# Altium project Capstone_Altium_Guide.PrjPcb
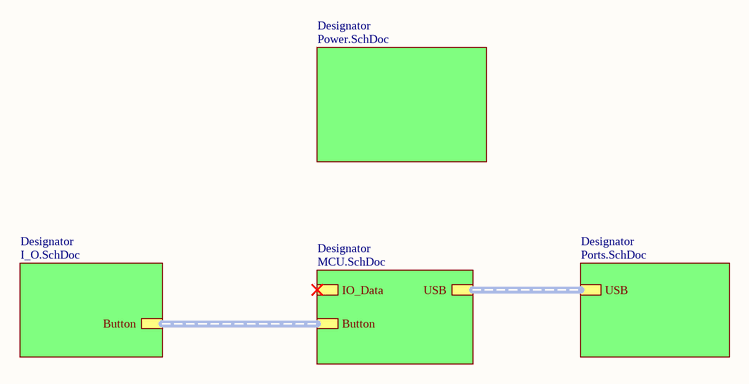
[diagram p0: Top_Level.SchDoc]
5 sheets, 56 parts. Net scope: hierarchical (ports join the sheet entries above them; power ports are global).
Board file: AltiumHandbook.PcbDoc
Sheets:
  Top_Level.SchDoc
    Designator = I_O.SchDoc
    Designator = MCU.SchDoc
    Designator = Ports.SchDoc
    Designator = Power.SchDoc

## Sheet Top_Level.SchDoc: ESP32 ESP Home Template
size A4; DrawnBy: Tim Baker; Revision: 1; SheetNumber: 1; SheetTotal: 5

### Sub-sheets
Designator = I_O.SchDoc: Button (harness Button)
Designator = MCU.SchDoc: IO_Data (harness IO), USB (harness USB), Button (harness Button)
Designator = Ports.SchDoc: USB (harness USB)
Designator = Power.SchDoc: no entries

## Sheet I_O.SchDoc
size A4; SheetNumber: 4; SheetTotal: 5
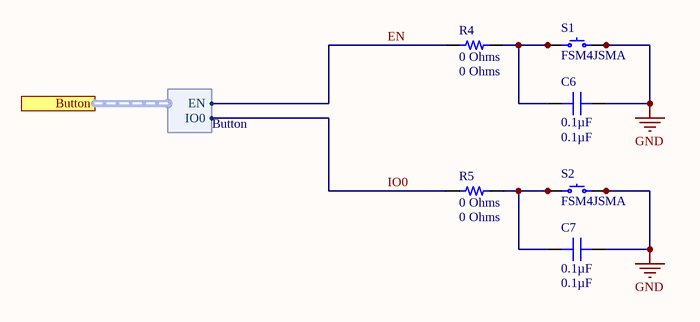
[diagram p1: I_O.SchDoc]

### Parts
C6  0.1µF  [CAP 0805_2012]
C7  0.1µF  [CAP 0805_2012]
R4  0 Ohms  [RES 0805_2012]
R5  0 Ohms  [RES 0805_2012]
S1  FSM4JSMA  [TE FSM4JSMA]
S2  FSM4JSMA  [TE FSM4JSMA]

### Ports
Button (harness Button)

### Harnesses
Button: EN, IO0

### Nets
GND: C6.1 C7.1 S1.3 S1.4 S2.3 S2.4
EN: R4.1 ; port Button.EN
IO0: R5.1 ; port Button.IO0
NetC6_2: C6.2 R4.2 S1.1 S1.2
NetC7_2: C7.2 R5.2 S2.1 S2.2

### Library data of the parts
C6 C7 = 0805ZD104KAT2A: CAP CER 0.1UF 10V X5R 0805; Part Number: 0805ZD104KAT2A; Value: 0.1µF
R4 R5 = CRCW08050000Z0EBC: RES 0 OHM JUMPER 1/8W 0805; Part Number: CRCW08050000Z0EBC; Value: 0 Ohms
S1 S2 = FSM4JSMA: SWITCH TACTILE SPST-NO 0.05A 24V; Manufacturer: TE Connectivity ALCOSWITCH Switches; Actuator Height off PCB, Vertical: 5.00mm; Actuator Orientation: Top Actuated; Actuator Type: Standard; Contact Rating @ Voltage: 0.05A @ 24VDC; Illumination: Non-Illuminated; Operating Force: 160gf; Outline: 6.00mm x 6.00mm; Switch Function: Off-Mom; Part Number: FSM4JSMA; Circuit: SPST-NO; ComponentLink1Description: Datasheet; ComponentLink1URL: https://www.te.com/commerce/DocumentDelivery/DDEController?Action=srchrtrv&DocNm=1308111-1_SWITCHES_CORE_PROGRAM_CATALOG&DocType=CS&DocLang=English; ComponentLink2Description: DigiKey Link; ComponentLink2URL: https://www.digikey.com/en/products/detail/te-connectivity-alcoswitch-switches/FSM4JSMA/525821; LastUpdated: 19/09/2022 2:02:57 PM; Lifecycle Status: Active; Minimum Order: 1; Mounting Type: Surface Mount; Operating Temperature: -35°C ~ 85°C; Packaging: Bulk; Part Status: Active; Price: 0.14; Series: FSMJSMA; Supplier 1: DigiKey; Supplier Part Number 1: 450-1129-ND; Termination Style: Gull Wing

## Sheet MCU.SchDoc
size A4; SheetNumber: 2; SheetTotal: 5
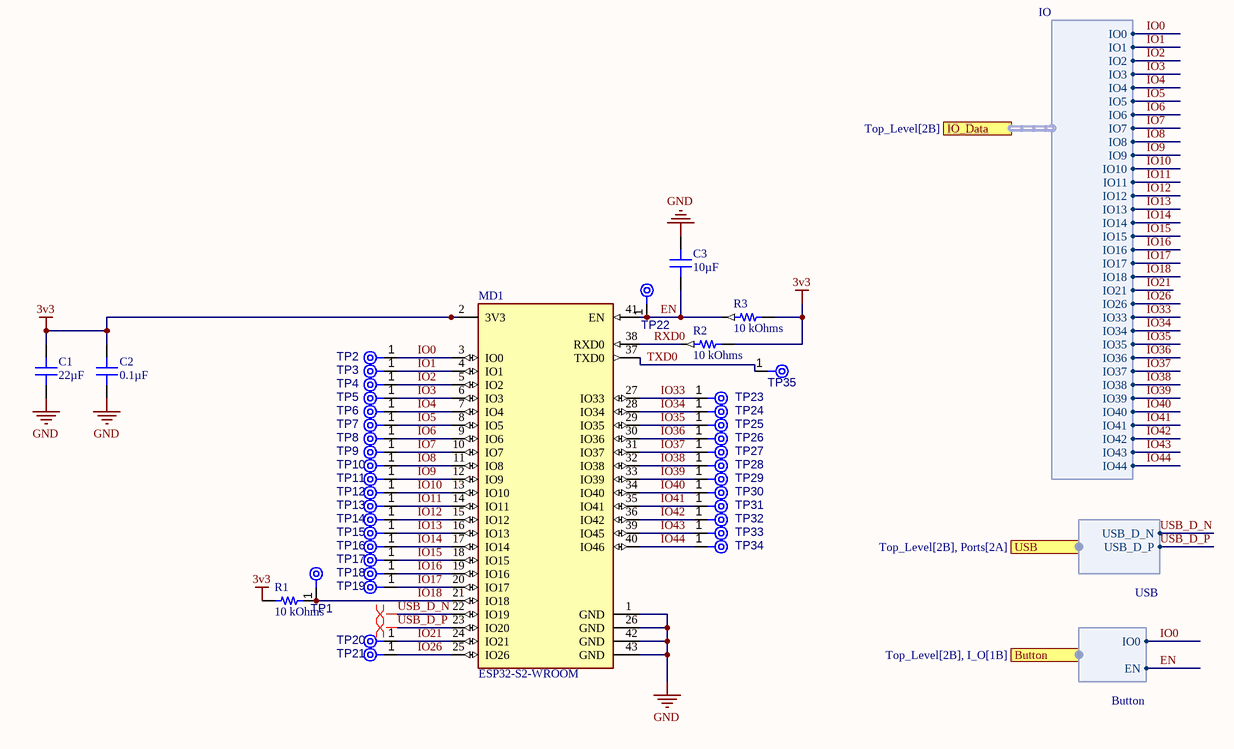
[diagram p2: MCU.SchDoc]

### Parts
C1  22µF  [CAP 0805_2012]
C2  0.1µF  [CAP 0805_2012]
C3  10µF  [CAP 0805_2012]
MD1  ESP32-S2-WROOM  [FP-ESP32-S2-WROOM-MFG]
R1  10 kOhms  [RES 0805_2012]
R2  10 kOhms  [RES 0805_2012]
R3  10 kOhms  [RES 0805_2012]
TP1  TPAD1.0R  [TP06R]  (value not drawn)  (no BOM)
TP2  TPAD1.0R  [TP06R]  (value not drawn)  (no BOM)
TP3  TPAD1.0R  [TP06R]  (value not drawn)  (no BOM)
TP4  TPAD1.0R  [TP06R]  (value not drawn)  (no BOM)
TP5  TPAD1.0R  [TP06R]  (value not drawn)  (no BOM)
TP6  TPAD1.0R  [TP06R]  (value not drawn)  (no BOM)
TP7  TPAD1.0R  [TP06R]  (value not drawn)  (no BOM)
TP8  TPAD1.0R  [TP06R]  (value not drawn)  (no BOM)
TP9  TPAD1.0R  [TP06R]  (value not drawn)  (no BOM)
TP10  TPAD1.0R  [TP06R]  (value not drawn)  (no BOM)
TP11  TPAD1.0R  [TP06R]  (value not drawn)  (no BOM)
TP12  TPAD1.0R  [TP06R]  (value not drawn)  (no BOM)
TP13  TPAD1.0R  [TP06R]  (value not drawn)  (no BOM)
TP14  TPAD1.0R  [TP06R]  (value not drawn)  (no BOM)
TP15  TPAD1.0R  [TP06R]  (value not drawn)  (no BOM)
TP16  TPAD1.0R  [TP06R]  (value not drawn)  (no BOM)
TP17  TPAD1.0R  [TP06R]  (value not drawn)  (no BOM)
TP18  TPAD1.0R  [TP06R]  (value not drawn)  (no BOM)
TP19  TPAD1.0R  [TP06R]  (value not drawn)  (no BOM)
TP20  TPAD1.0R  [TP06R]  (value not drawn)  (no BOM)
TP21  TPAD1.0R  [TP06R]  (value not drawn)  (no BOM)
TP22  TPAD1.0R  [TP06R]  (value not drawn)  (no BOM)
TP23  TPAD1.0R  [TP06R]  (value not drawn)  (no BOM)
TP24  TPAD1.0R  [TP06R]  (value not drawn)  (no BOM)
TP25  TPAD1.0R  [TP06R]  (value not drawn)  (no BOM)
TP26  TPAD1.0R  [TP06R]  (value not drawn)  (no BOM)
TP27  TPAD1.0R  [TP06R]  (value not drawn)  (no BOM)
TP28  TPAD1.0R  [TP06R]  (value not drawn)  (no BOM)
TP29  TPAD1.0R  [TP06R]  (value not drawn)  (no BOM)
TP30  TPAD1.0R  [TP06R]  (value not drawn)  (no BOM)
TP31  TPAD1.0R  [TP06R]  (value not drawn)  (no BOM)
TP32  TPAD1.0R  [TP06R]  (value not drawn)  (no BOM)
TP33  TPAD1.0R  [TP06R]  (value not drawn)  (no BOM)
TP34  TPAD1.0R  [TP06R]  (value not drawn)  (no BOM)
TP35  TPAD1.0R  [TP06R]  (value not drawn)  (no BOM)

### Ports
Button (harness Button, see Top_Level[2B], I_O[1B]), IO_Data (harness IO, see Top_Level[2B]), USB (harness USB, see Top_Level[2B], Ports[2A])

### Harnesses
IO: IO0, IO1, IO2, IO3, IO4, IO5, IO6, IO7, IO8, IO9, IO10, IO11, IO12, IO13, IO14, IO15, IO16, IO17, IO18, IO21, IO26, IO33, IO34, IO35, IO36, IO37, IO38, IO39, IO40, IO41, IO42, IO43, IO44
USB: USB_D_P, USB_D_N
Button: EN, IO0

### Nets
3v3: C1.1 C2.1 MD1.2(3V3) R1.1 R2.2 R3.2
GND: C1.2 C2.2 C3.2 MD1.1(GND) MD1.26(GND) MD1.42(GND) MD1.43(GND)
EN: C3.1 MD1.41(EN) R3.1 TP22.1(TP) ; port Button.EN
IO0: MD1.3(IO0) TP2.1(TP) ; port IO_Data.IO0, port Button.IO0
IO1: MD1.4(IO1) TP3.1(TP) ; port IO_Data.IO1
IO2: MD1.5(IO2) TP4.1(TP) ; port IO_Data.IO2
IO3: MD1.6(IO3) TP5.1(TP) ; port IO_Data.IO3
IO4: MD1.7(IO4) TP6.1(TP) ; port IO_Data.IO4
IO5: MD1.8(IO5) TP7.1(TP) ; port IO_Data.IO5
IO6: MD1.9(IO6) TP8.1(TP) ; port IO_Data.IO6
IO7: MD1.10(IO7) TP9.1(TP) ; port IO_Data.IO7
IO8: MD1.11(IO8) TP10.1(TP) ; port IO_Data.IO8
IO9: MD1.12(IO9) TP11.1(TP) ; port IO_Data.IO9
IO10: MD1.13(IO10) TP12.1(TP) ; port IO_Data.IO10
IO11: MD1.14(IO11) TP13.1(TP) ; port IO_Data.IO11
IO12: MD1.15(IO12) TP14.1(TP) ; port IO_Data.IO12
IO13: MD1.16(IO13) TP15.1(TP) ; port IO_Data.IO13
IO14: MD1.17(IO14) TP16.1(TP) ; port IO_Data.IO14
IO15: MD1.18(IO15) TP17.1(TP) ; port IO_Data.IO15
IO16: MD1.19(IO16) TP18.1(TP) ; port IO_Data.IO16
IO17: MD1.20(IO17) TP19.1(TP) ; port IO_Data.IO17
IO18: MD1.21(IO18) R1.2 TP1.1(TP) ; port IO_Data.IO18
IO21: MD1.24(IO21) TP20.1(TP) ; port IO_Data.IO21
IO26: MD1.25(IO26) TP21.1(TP) ; port IO_Data.IO26
IO33: MD1.27(IO33) TP23.1(TP) ; port IO_Data.IO33
IO34: MD1.28(IO34) TP24.1(TP) ; port IO_Data.IO34
IO35: MD1.29(IO35) TP25.1(TP) ; port IO_Data.IO35
IO36: MD1.30(IO36) TP26.1(TP) ; port IO_Data.IO36
IO37: MD1.31(IO37) TP27.1(TP) ; port IO_Data.IO37
IO38: MD1.32(IO38) TP28.1(TP) ; port IO_Data.IO38
IO39: MD1.33(IO39) TP29.1(TP) ; port IO_Data.IO39
IO40: MD1.34(IO40) TP30.1(TP) ; port IO_Data.IO40
IO41: MD1.35(IO41) TP31.1(TP) ; port IO_Data.IO41
IO42: MD1.36(IO42) TP32.1(TP) ; port IO_Data.IO42
IO43: MD1.39(IO45) TP33.1(TP) ; port IO_Data.IO43
IO44: MD1.40(IO46) TP34.1(TP) ; port IO_Data.IO44
RXD0: MD1.38(RXD0) R2.1  [project net RXD0_2]
TXD0: MD1.37(TXD0) TP35.1(TP)  [project net TXD0_2]
USB_D_N: MD1.22(IO19) ; port USB.USB_D_N
USB_D_P: MD1.23(IO20) ; port USB.USB_D_P

### Layout directives
differential pair; differential pair class USB 2.0 90 OHM: USB_D_N, USB_D_P

### Library data of the parts
C1 = 0805ZD226MAT2A: CAP CER 22UF 10V X5R 0805; manufacturer: AVX Corporation; Tolerance: ±20%; Part Number: 0805ZD226MAT2A; Value: 22µF; Applications: General Purpose; Capacitance: 22µF; componentlink1description: Datasheet; componentlink1url: http://datasheets.avx.com/cx5r.pdf; componentlink2description: DigiKey Link; componentlink2url: http://digikey.com/product-detail/en/avx-corporation/0805ZD226MAT2A/478-7966-1-ND/3881589; Device Package: 0805 (2012 Metric); lastupdated: 2/09/2020 1:04:32 AM; Lifecycle Status: Active; Minimum Order: 1; Mounting Type: Surface Mount, MLCC; Operating Temperature: -55°C ~ 85°C; Package / Case: 0805 (2012 Metric); packaging: TapeAndReel; partid: 7750; Part Status: Active; price: 0.10; series: -; Size / Dimension: 0.079" L x 0.049" W (2.00mm x 1.25mm); Supplier 1: DigiKey; Supplier Part Number 1: 478-7966-1-ND; Temperature Coefficient: X5R; Thickness (Max): 0.060" (1.52mm); Voltage - Rated: 10V
C2 = 0805ZC104KAT2A: CAP CER 0.1UF 10V X7R 0805; manufacturer: AVX Corporation; Tolerance: ±10%; Part Number: 0805ZC104KAT2A; Value: 0.1µF; Applications: General Purpose; Capacitance: 0.1µF; componentlink1description: Datasheet; componentlink1url: http://datasheets.avx.com/X7RDielectric.pdf; componentlink2description: DigiKey Link; componentlink2url: http://digikey.com/product-detail/en/avx-corporation/0805ZC104KAT2A/478-7962-1-ND/3881585; Device Package: 0805 (2012 Metric); lastupdated: 2/09/2020 1:04:08 AM; Lifecycle Status: Active; Minimum Order: 1; Mounting Type: Surface Mount, MLCC; Operating Temperature: -55°C ~ 125°C; Package / Case: 0805 (2012 Metric); packaging: TapeAndReel; partid: 17952; Part Status: Active; price: 0.05; series: -; Size / Dimension: 0.079" L x 0.049" W (2.00mm x 1.25mm); Supplier 1: DigiKey; Supplier Part Number 1: 478-7962-1-ND; Temperature Coefficient: X7R; Thickness (Max): 0.037" (0.94mm); Voltage - Rated: 10V
C3 = 0805ZD106KAT4A: CAP CER 10UF 10V X5R 0805; manufacturer: AVX Corporation; Tolerance: ±10%; Part Number: 0805ZD106KAT4A; Value: 10µF; Applications: General Purpose; Capacitance: 10µF; componentlink1description: Datasheet; componentlink1url: http://datasheets.avx.com/cx5r.pdf; componentlink2description: DigiKey Link; componentlink2url: http://digikey.com/product-detail/en/avx-corporation/0805ZD106KAT4A/478-10579-1-ND/6797452; Device Package: 0805 (2012 Metric); lastupdated: 2/09/2020 1:04:37 AM; Lifecycle Status: Active; Minimum Order: 1; Mounting Type: Surface Mount, MLCC; Operating Temperature: -55°C ~ 85°C; Package / Case: 0805 (2012 Metric); packaging: TapeAndReel; partid: 5023; Part Status: Active; price: 0.12; series: -; Size / Dimension: 0.079" L x 0.049" W (2.01mm x 1.25mm); Supplier 1: DigiKey; Supplier Part Number 1: 478-10579-1-ND; Temperature Coefficient: X5R; Thickness (Max): 0.055" (1.40mm); Voltage - Rated: 10V
MD1 = CMP-194065-000020-1: RX TXRX MOD WIFI SURFACE MOUNT
R1-R3 = RK73H2ATTD1002D: RES 10K OHM 0.5% 1/4W 0805; Manufacturer: KOA Speer Electronics, Inc.; Power (Watts): 0.25W, 1/4W; Temperature Coefficient: ±100ppm/°C; Part Number: RK73H2ATTD1002D; Value: 10 kOhms; ComponentLink1Description: Datasheet; ComponentLink1URL: http://www.koaspeer.com/catimages/Products/RK73H/RK73H.pdf; ComponentLink2Description: DigiKey Link; ComponentLink2URL: https://www.digikey.com/en/products/detail/koa-speer-electronics-inc/RK73H2ATTD1002D/10234245; Composition: Thick Film; Device Package: 0805 (2012 Metric); Features: Automotive AEC-Q200, Moisture Resistant; Height - Seated (Max): 0.024" (0.60mm); LastUpdated: 19/09/2022 1:36:24 PM; Lifecycle Status: Active; Minimum Order: 0; Number of Terminations: 2; Operating Temperature: -55°C ~ 155°C; Package / Case: 0805 (2012 Metric); PartId: 37623; Part Status: Active; Price: 0; Ratings: AEC-Q200; Resistance: 10 kOhms; Series: RK73H; Size / Dimension: 0.079" L x 0.049" W (2.00mm x 1.25mm); Supplier 1: DigiKey; Supplier Part Number 1: 2019-RK73H2ATTD1002DTR-ND; Supplier Device Package: 0805; Tolerance: ±0.5%
TP1-TP35 = CMP-00028-00010-1: 1.0mm round testpoint; Pins: 1

## Sheet Ports.SchDoc
size A4; SheetNumber: 5; SheetTotal: 5
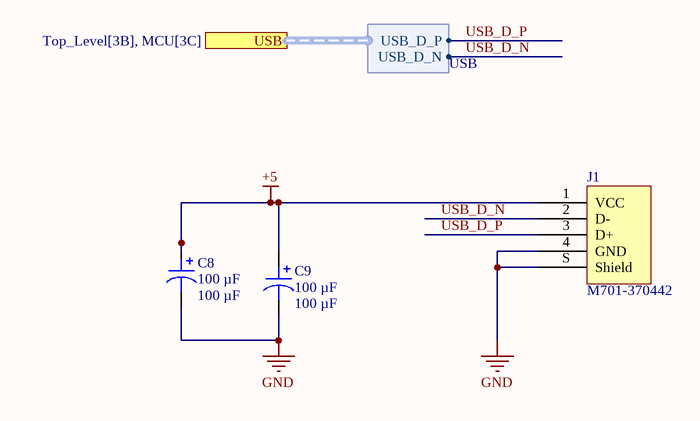
[diagram p3: Ports.SchDoc]

### Parts
C8  100 µF  [CAP POL 2917_7343]
C9  100 µF  [CAP POL 2917_7343]
J1  M701-370442  [HARWIN USB M701-370442]

### Ports
USB (harness USB, see Top_Level[3B], MCU[3C])

### Harnesses
USB: USB_D_N, USB_D_P

### Nets
+5: C8.1 C9.1 J1.1(VCC)
GND: C8.2 C9.2 J1.4(GND) J1.S(Shield)
USB_D_N: J1.2(D-) ; port USB.USB_D_N
USB_D_P: J1.3(D+) ; port USB.USB_D_P

### Library data of the parts
C8 C9 = T491X107K020AT: CAP TANT 100UF 10% 20V 2917; Part Number: T491X107K020AT; Value: 100 µF
J1 = M701-370442: CONN RCPT USB2.0 TYPEB 4P SMD RA; Part Number: M701-370442

## Sheet Power.SchDoc
size A4; SheetNumber: 3; SheetTotal: 5
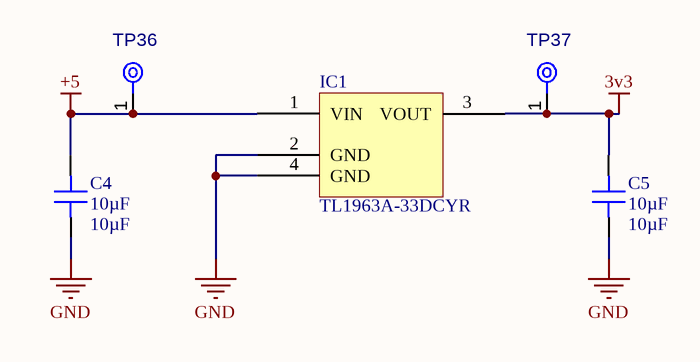
[diagram p4: Power.SchDoc]

### Parts
C4  10µF  [CAP 0805_2012]
C5  10µF  [CAP 0805_2012]
IC1  TL1963A-33DCYR  [TI SOT-223 DCY]
TP36  TPAD1.0R  [TP06R]  (value not drawn)  (no BOM)
TP37  TPAD1.0R  [TP06R]  (value not drawn)  (no BOM)

### Nets
3v3: C5.2 IC1.3(VOUT) TP37.1(TP)
+5: C4.2 IC1.1(VIN) TP36.1(TP)
GND: C4.1 C5.1 IC1.2(GND) IC1.4(GND)

### Library data of the parts
C4 C5 = 0805ZD106KAT4A: CAP CER 10UF 10V X5R 0805; Part Number: 0805ZD106KAT4A; Value: 10µF
IC1 = TL1963A-33DCYR: IC REG LINEAR 3.3V 1.5A SOT223-4; Manufacturer: Texas Instruments; Control Features: Enable; Current - Quiescent (Iq): 1mA; Current - Supply (Max): 80mA; Number of Regulators: 1; Output Configuration: Positive; Output Type: Fixed; Protection Features: Over Temperature, Reverse Polarity; PSRR: 63dB (120Hz); Voltage Dropout (Max): 0.55V @ 1.5A; Voltage - Input (Max): 20V; Part Number: TL1963A-33DCYR; ComponentLink1Description: Datasheet; ComponentLink1URL: http://www.ti.com/general/docs/suppproductinfo.tsp?distId=10&gotoUrl=http%3A%2F%2Fwww.ti.com%2Flit%2Fgpn%2Ftl1963a; ComponentLink2Description: DigiKey Link; ComponentLink2URL: http://digikey.com/product-detail/en/texas-instruments/TL1963A-33DCYR/296-24897-1-ND/2118661; Current - Output: 1.5A; LastUpdated: 19/09/2022 2:06:57 PM; Lifecycle Status: Active; Minimum Order: 1; Mounting Type: Surface Mount; Operating Temperature: -40°C ~ 125°C; Package / Case: TO-261-4, TO-261AA; Packaging: TapeAndReel; Part Status: Active; Price: 1.26; Series: -; Supplier 1: DigiKey; Supplier Part Number 1: 296-24897-1-ND; Supplier Device Package: SOT-223-4; Voltage - Output (Min/Fixed): 3.3V
TP36 TP37 = CMP-00028-00010-1: 1.0mm round testpoint; Pins: 1

## Nets that join several sheets
3v3: MCU (6 pins), Power (C5.2 IC1.3 TP37.1)
+5: Ports (C8.1 C9.1 J1.1), Power (C4.2 IC1.1 TP36.1)
GND: I_O (6 pins), MCU (7 pins), Ports (C8.2 C9.2 J1.4 J1.S), Power (C4.1 C5.1 IC1.2 IC1.4)
EN: I_O (R4.1), MCU (C3.1 MD1.41 R3.1 TP22.1)
IO0: I_O (R5.1), MCU (MD1.3 TP2.1)
USB_D_N: MCU (MD1.22), Ports (J1.2)
USB_D_P: MCU (MD1.23), Ports (J1.3)

## Assembly variants
Variant of Capstone_Altium_Guide: not fitted C5 C8